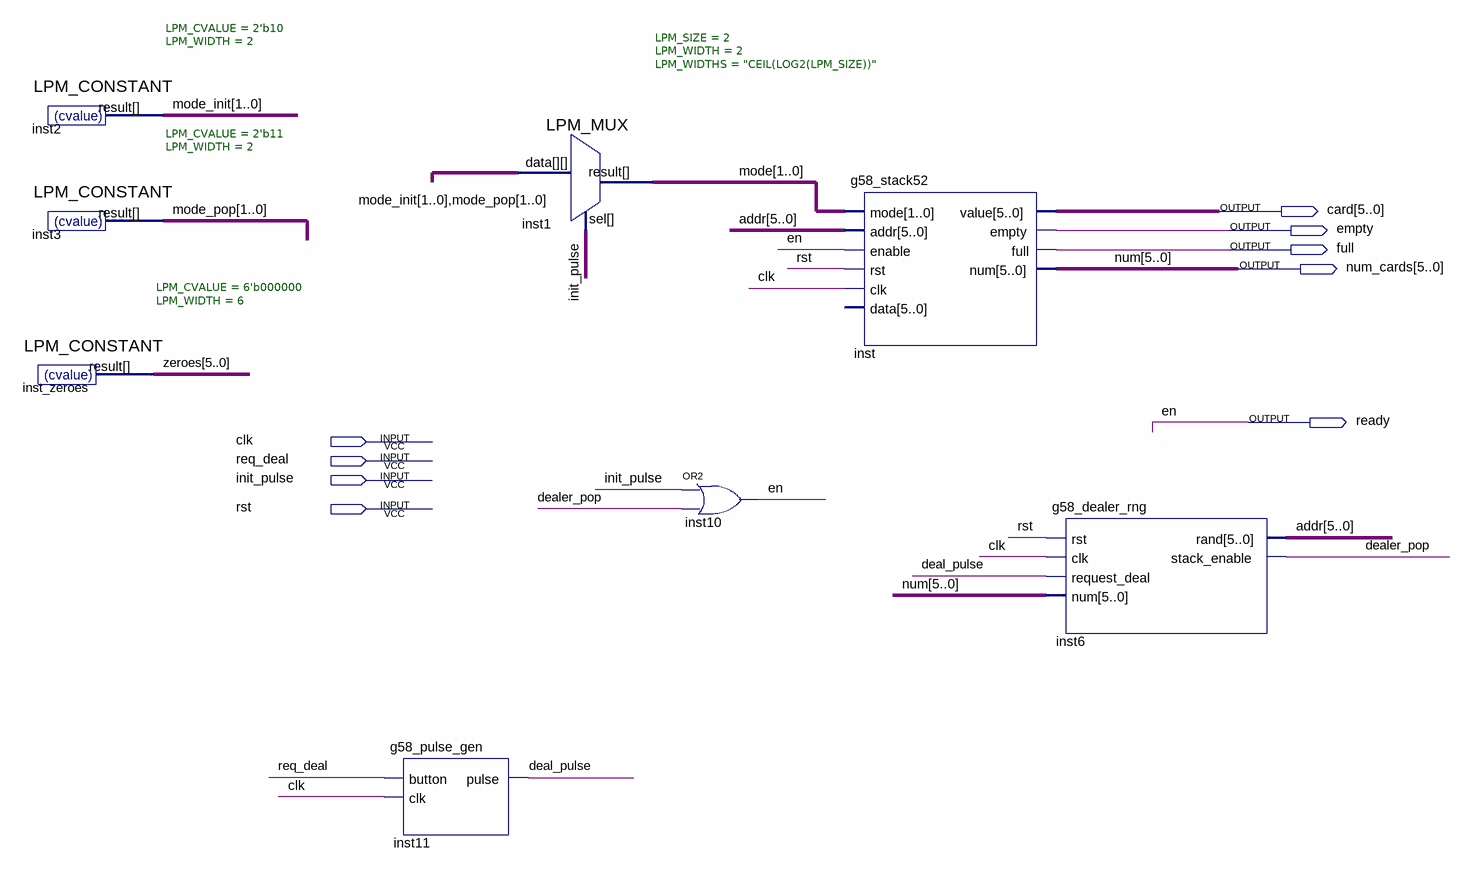
[diagram p0: schematic sheet]
// Quartus schematic g58_play_deck.bdf as structural Verilog: 8 symbols, 9 pins
module g58_play_deck (
  input  clk,
  input  req_deal,
  input  init_pulse,
  input  rst,
  output [5:0] card,
  output empty,
  output full,
  output [5:0] num_cards,
  output ready
);

  wire deal_pulse, dealer_pop;
  wire [1:0] mode, mode_init, mode_pop;
  wire [5:0] addr, zeroes;

  LPM_CONSTANT #(.LPM_CVALUE(6'b000000), .LPM_WIDTH(6)) inst_zeroes (.result(zeroes));
  LPM_CONSTANT #(.LPM_CVALUE(2'b10), .LPM_WIDTH(2)) inst2 (.result(mode_init));
  LPM_CONSTANT #(.LPM_CVALUE(2'b11), .LPM_WIDTH(2)) inst3 (.result(mode_pop));
  g58_pulse_gen inst11 (.button(req_deal), .clk(clk), .pulse(deal_pulse));
  LPM_MUX #(.LPM_SIZE(2), .LPM_WIDTH(2), .LPM_WIDTHS("CEIL(LOG2(LPM_SIZE))")) inst1 (
    .data({mode_init, mode_pop}), .sel(init_pulse), .result(mode));
  or inst10 (ready, init_pulse, dealer_pop);
  g58_stack52 inst (
    .mode(mode), .addr(addr), .enable(ready), .rst(rst), .clk(clk), .value(card), .empty(empty), .full(full),
    .num(num_cards));  // open: data
  g58_dealer_rng inst6 (
    .rst(rst), .clk(clk), .request_deal(deal_pulse), .num(num_cards), .\rand (addr), .stack_enable(dealer_pop));

  // Other names for the same wires on the sheet: en = ready; num[5:0] = num_cards
endmodule
